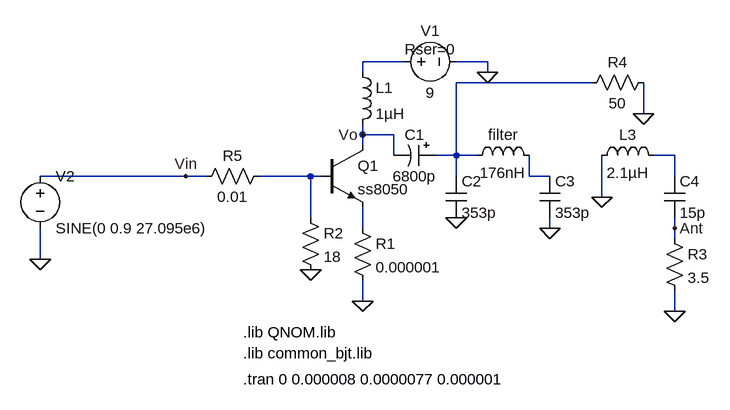
[diagram p0: schematic 27Mhz-PA-improvement.asc]
27Mhz-PA-improvement.asc, the LTspice schematic file:
Version 4
SHEET 1 880 680
WIRE 256 -32 192 -32
WIRE 384 -32 336 -32
WIRE 192 -16 192 -32
WIRE 384 -16 384 -32
WIRE 544 0 336 0
WIRE 624 48 624 0
WIRE 192 80 192 64
WIRE 240 80 192 80
WIRE 192 96 192 80
WIRE 240 112 240 80
WIRE 336 112 336 0
WIRE 336 112 304 112
WIRE 368 112 336 112
WIRE 672 112 640 112
WIRE -80 144 -304 144
WIRE -48 144 -80 144
WIRE 112 144 32 144
WIRE 128 144 112 144
WIRE 336 144 336 112
WIRE 448 144 448 112
WIRE 480 144 448 144
WIRE 672 144 672 112
WIRE 560 176 560 112
WIRE 112 208 112 144
WIRE 192 224 192 192
WIRE 480 224 480 208
WIRE 672 224 672 208
WIRE 672 240 672 224
WIRE -304 272 -304 224
WIRE 192 336 192 304
WIRE 672 352 672 320
FLAG 192 336 0
FLAG 336 208 0
FLAG 480 224 0
FLAG 384 -16 0
FLAG 672 352 0
FLAG -304 272 0
FLAG 672 224 Ant
FLAG 624 48 0
FLAG -80 144 Vin
FLAG 192 80 Vo
FLAG 560 176 0
FLAG 112 288 0
SYMBOL res 176 208 R0
SYMATTR InstName R1
SYMATTR Value 0.000001
SYMATTR SpiceLine tol=1% pwr=1
SYMBOL ind 176 -32 R0
SYMATTR InstName L1
SYMATTR Value 1µH
SYMATTR SpiceLine Ipk=1 Rser=0.0478 Rpar=1e4 Cpar=0
SYMBOL ind 352 128 R270
WINDOW 0 32 56 VTop 2
WINDOW 3 5 56 VBottom 2
SYMATTR InstName filter
SYMATTR Value 176nH
SYMATTR SpiceLine Ipk=1 Rser=0.03 Rpar=1e4 Cpar=0.3p
SYMBOL polcap 304 96 R90
WINDOW 0 0 32 VBottom 2
WINDOW 3 32 32 VTop 2
SYMATTR InstName C1
SYMATTR Value 6800p
SYMATTR Description Capacitor
SYMATTR Type cap
SYMATTR SpiceLine V=33 Irms=0.5 Rser=0.01 Lser=0 Rpar=1e4 Cpar=0.1e-12
SYMBOL cap 320 144 R0
SYMATTR InstName C2
SYMATTR Value 353p
SYMATTR SpiceLine V=100 Irms=1 Rser=0.01 Lser=0 Rpar=1e5 Cpar=0
SYMBOL cap 464 144 R0
SYMATTR InstName C3
SYMATTR Value 353p
SYMATTR SpiceLine V=100 Irms=0.7 Rser=0.03 Lser=0 Rpar=1e5 Cpar=0
SYMBOL npn 128 96 R0
SYMATTR InstName Q1
SYMATTR Value ss8050
SYMBOL ind 544 128 R270
WINDOW 0 32 56 VTop 2
WINDOW 3 5 56 VBottom 2
SYMATTR InstName L3
SYMATTR Value 2.1µH
SYMATTR SpiceLine Ipk=1 Rser=0.03 Rpar=1e4 Cpar=0.3p
SYMBOL cap 656 144 R0
SYMATTR InstName C4
SYMATTR Value 15p
SYMATTR SpiceLine V=100 Irms=0.7 Rser=0.03 Lser=10nH Rpar=1e5 Cpar=0
SYMBOL res 656 224 R0
SYMATTR InstName R3
SYMATTR Value 3.5
SYMATTR SpiceLine tol=1% pwr=1
SYMBOL voltage 240 -32 R270
WINDOW 0 32 56 VTop 2
WINDOW 3 -32 56 VBottom 2
WINDOW 123 0 0 Left 2
WINDOW 39 4 56 VTop 2
SYMATTR InstName V1
SYMATTR Value 9
SYMATTR SpiceLine Rser=0
SYMBOL voltage -304 128 R0
WINDOW 123 0 0 Left 2
WINDOW 39 0 0 Left 2
SYMATTR InstName V2
SYMATTR Value SINE(0 0.9 27.095e6)
SYMBOL res 528 16 R270
WINDOW 0 32 56 VTop 2
WINDOW 3 0 56 VBottom 2
SYMATTR InstName R4
SYMATTR Value 50
SYMATTR SpiceLine tol=1% pwr=1
SYMBOL res -64 160 R270
WINDOW 0 32 56 VTop 2
WINDOW 3 0 56 VBottom 2
SYMATTR InstName R5
SYMATTR Value 0.01
SYMATTR SpiceLine tol=1% pwr=1
SYMBOL res 96 192 R0
SYMATTR InstName R2
SYMATTR Value 18
SYMATTR SpiceLine tol=1% pwr=1
TEXT 8 416 Left 2 !.lib common_bjt.lib
TEXT 8 456 Left 2 !.tran 0 0.000008 0.0000077 0.000001
TEXT 8 384 Left 2 !.lib QNOM.lib

The netlist it stands for:
* 27Mhz-PA-improvement.asc
R1 N006 0 0.000001 tol=1% pwr=1
L1 N001 Vo 1µH Ipk=1 Rser=0.0478 Rpar=1e4 Cpar=0
L§filter N002 N005 176nH Ipk=1 Rser=0.03 Rpar=1e4 Cpar=0.3p
C1 N002 Vo 6800p V=33 Irms=0.5 Rser=0.01 Lser=0 Rpar=1e4 Cpar=0.1e-12
C2 N002 0 353p V=100 Irms=1 Rser=0.01 Lser=0 Rpar=1e5 Cpar=0
C3 N005 0 353p V=100 Irms=0.7 Rser=0.03 Lser=0 Rpar=1e5 Cpar=0
Q1 Vo N004 N006 0 ss8050
L3 0 N003 2.1µH Ipk=1 Rser=0.03 Rpar=1e4 Cpar=0.3p
C4 N003 Ant 15p V=100 Irms=0.7 Rser=0.03 Lser=10nH Rpar=1e5 Cpar=0
R3 Ant 0 3.5 tol=1% pwr=1
V1 N001 0 9 Rser=0
V2 Vin 0 SINE(0 0.9 27.095e6)
R4 N002 0 50 tol=1% pwr=1
R5 Vin N004 0.01 tol=1% pwr=1
R2 N004 0 18 tol=1% pwr=1
.model NPN NPN
.model PNP PNP
.lib standard.bjt
.lib common_bjt.lib
.tran 0 0.000008 0.0000077 0.000001
.lib QNOM.lib
.backanno
.end